# Altium schematic sheet 08. SOC GPIO_MAPPING_TABLE.SchDoc: SOC GPIO_MAPPING_TABLE
size 513 x 386 mm; Project: PROC154E2(001)_SK_AM69; Issue: 1.0; RevCode: E3; Page Create Date: March  8, 1995; Variant Name: Core Design; Schematic Page Number: 8; Page Number: 8; Page Size: C; Comment: MISTRAL_TITLEBLK_CSIZE_1; Page Count: 62; Schematic Page Count: 62; Name: PROC154E2 001 SK AM69; DsnPath: C:\Users\danie\Downloads\sprr466c\PROC154E3_RP\PROC154E3_SCH.DSN; SchematicName: SCHEMATIC1; PageName: 08. SOC GPIO_MAPPING_TABLE; PageSize: C; TopSchematic: True
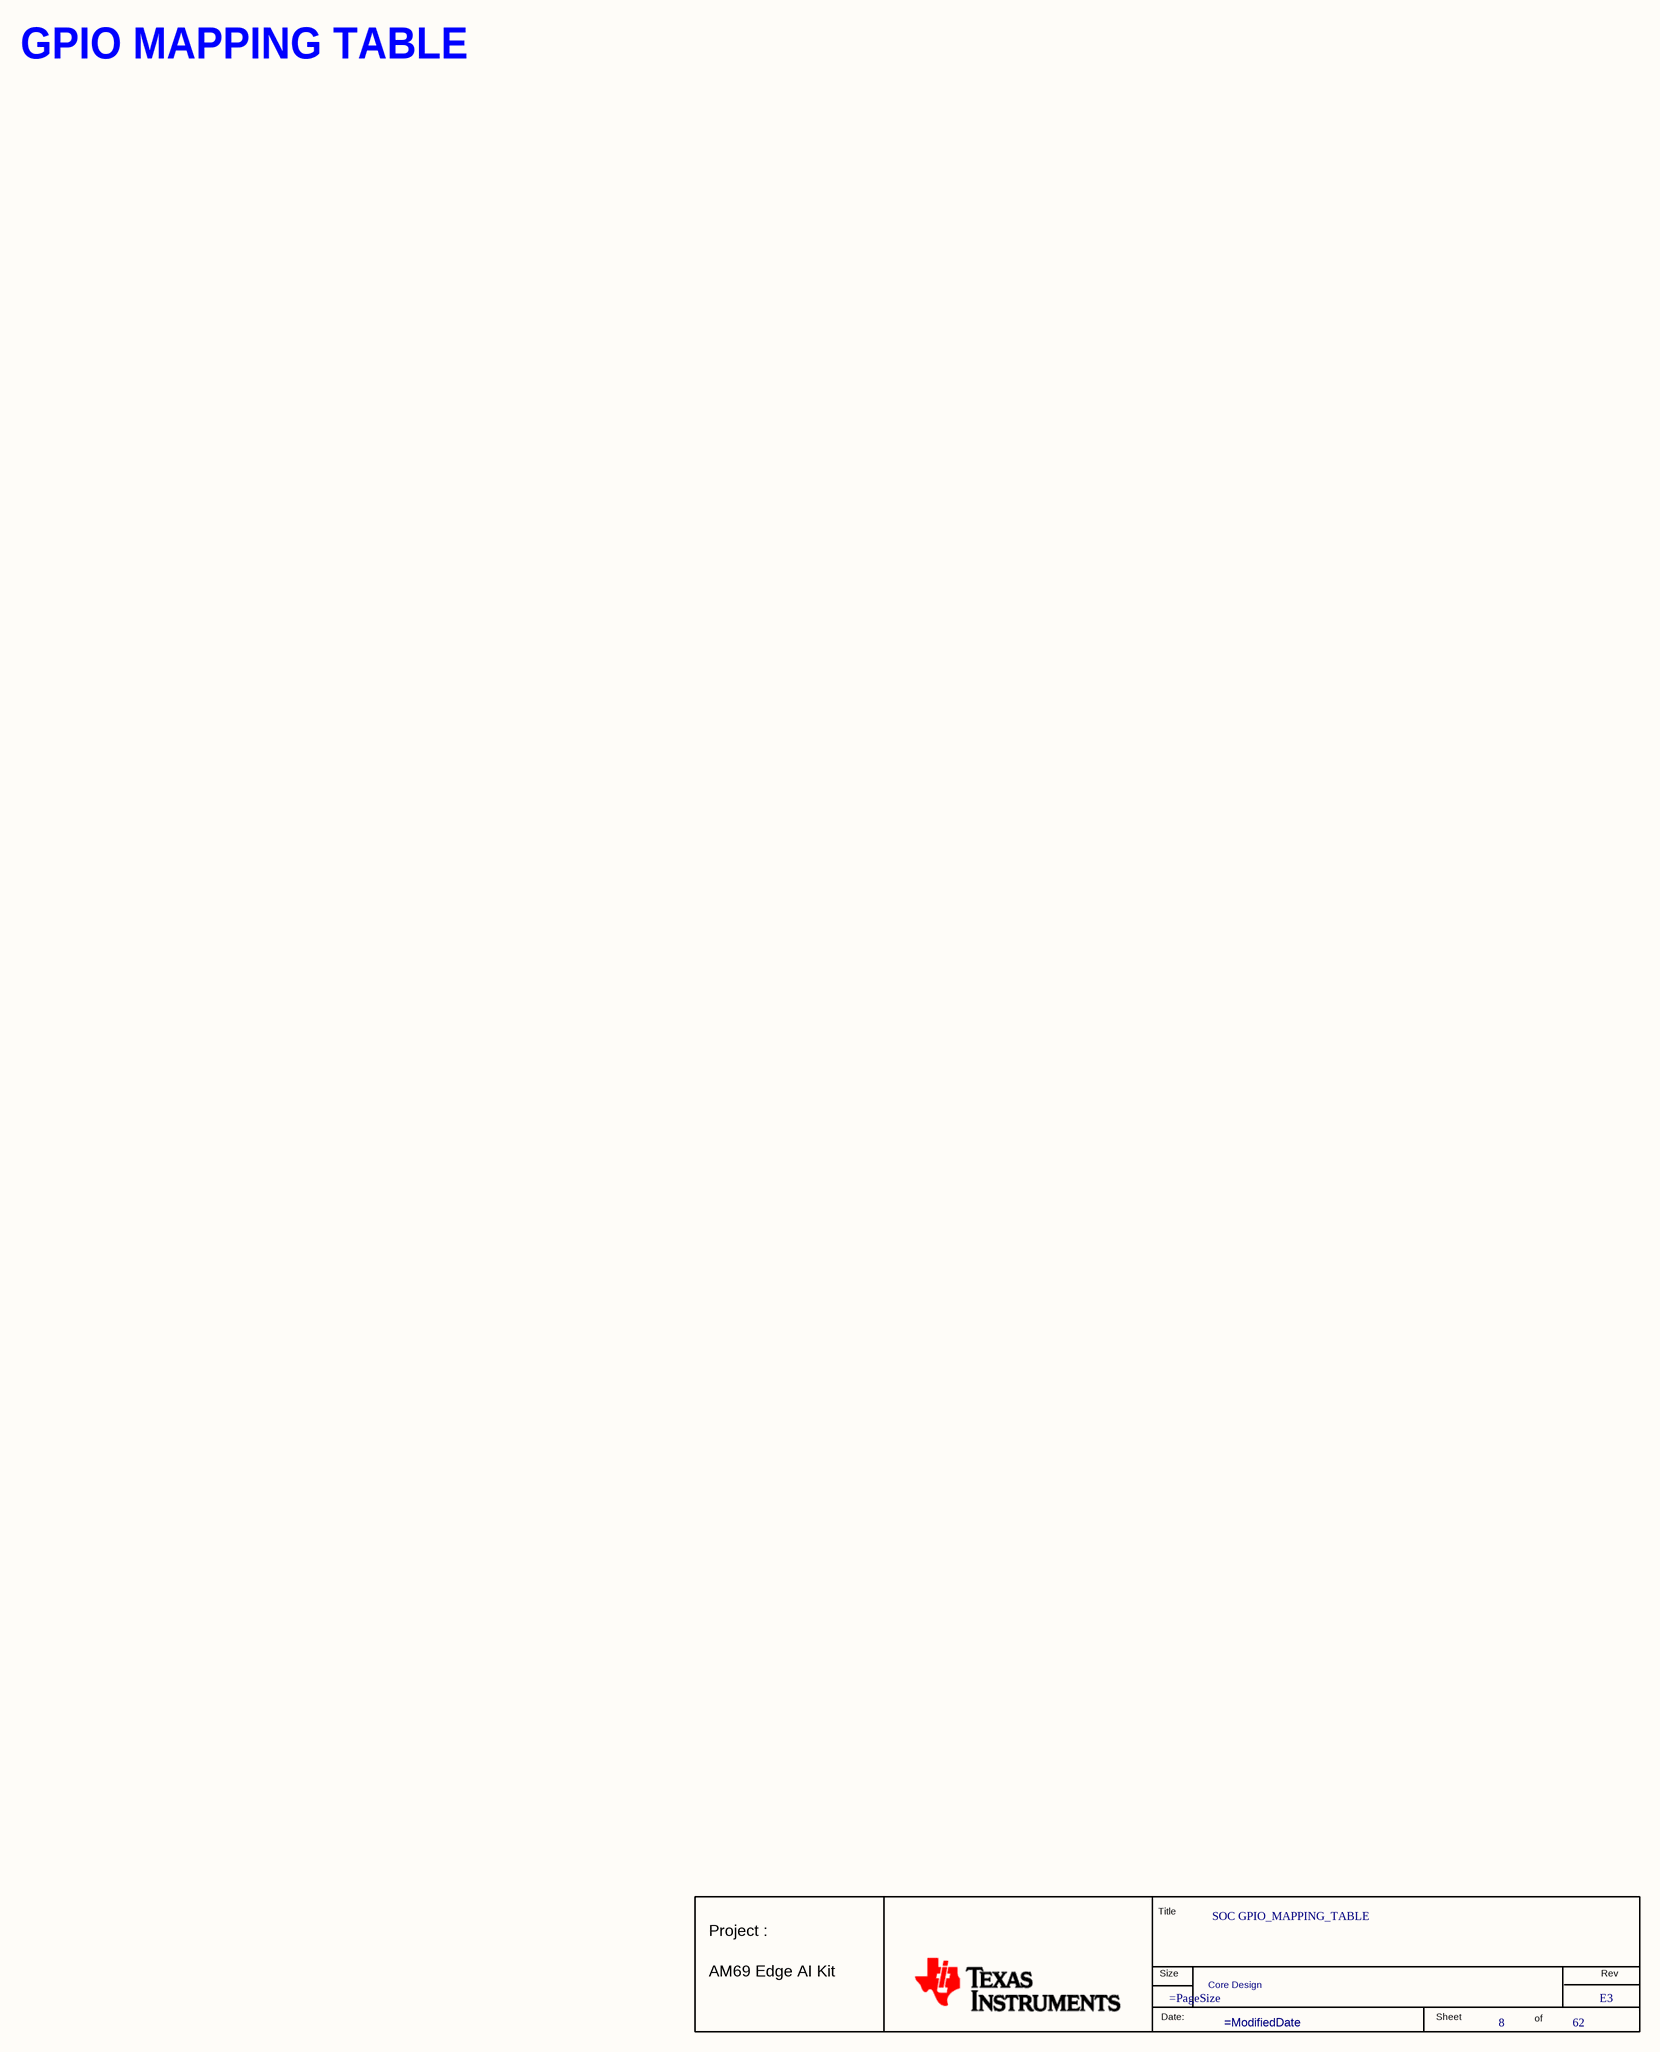
[diagram p0: 08. SOC GPIO_MAPPING_TABLE.SchDoc]

## Parts
*  RevCode: E3  Title: SOC GPIO_MAPPING_TABLE  Page Number: 8  Page Count: 62  Variant Name: Core Design  (hidden comment: MISTRAL_TITLEBLK_CSIZE_1)  (graphical)

## Notes on the sheet
- GPIO MAPPING TABLE
- (in symbol MISTRAL_TITLEBLK_CSIZE_1) Title; Project :; Size; Rev; AM69 Edge AI Kit; Date:; Sheet; of

## Library data of the parts
* = MISTRAL_TITLEBLK_CSIZE_1: Issue: 1.0; Project: PROC154E2(001)_SK_AM69; Name: PROC154E2 001 SK AM69; Page Create Date: March  8, 1995; Page Size: =PageSize; Page Modify Date: =ModifiedDate; Schematic Page Count: 62; Schematic Page Number: 8